# EAGLE design StepDown (EAGLE 6.5.0)
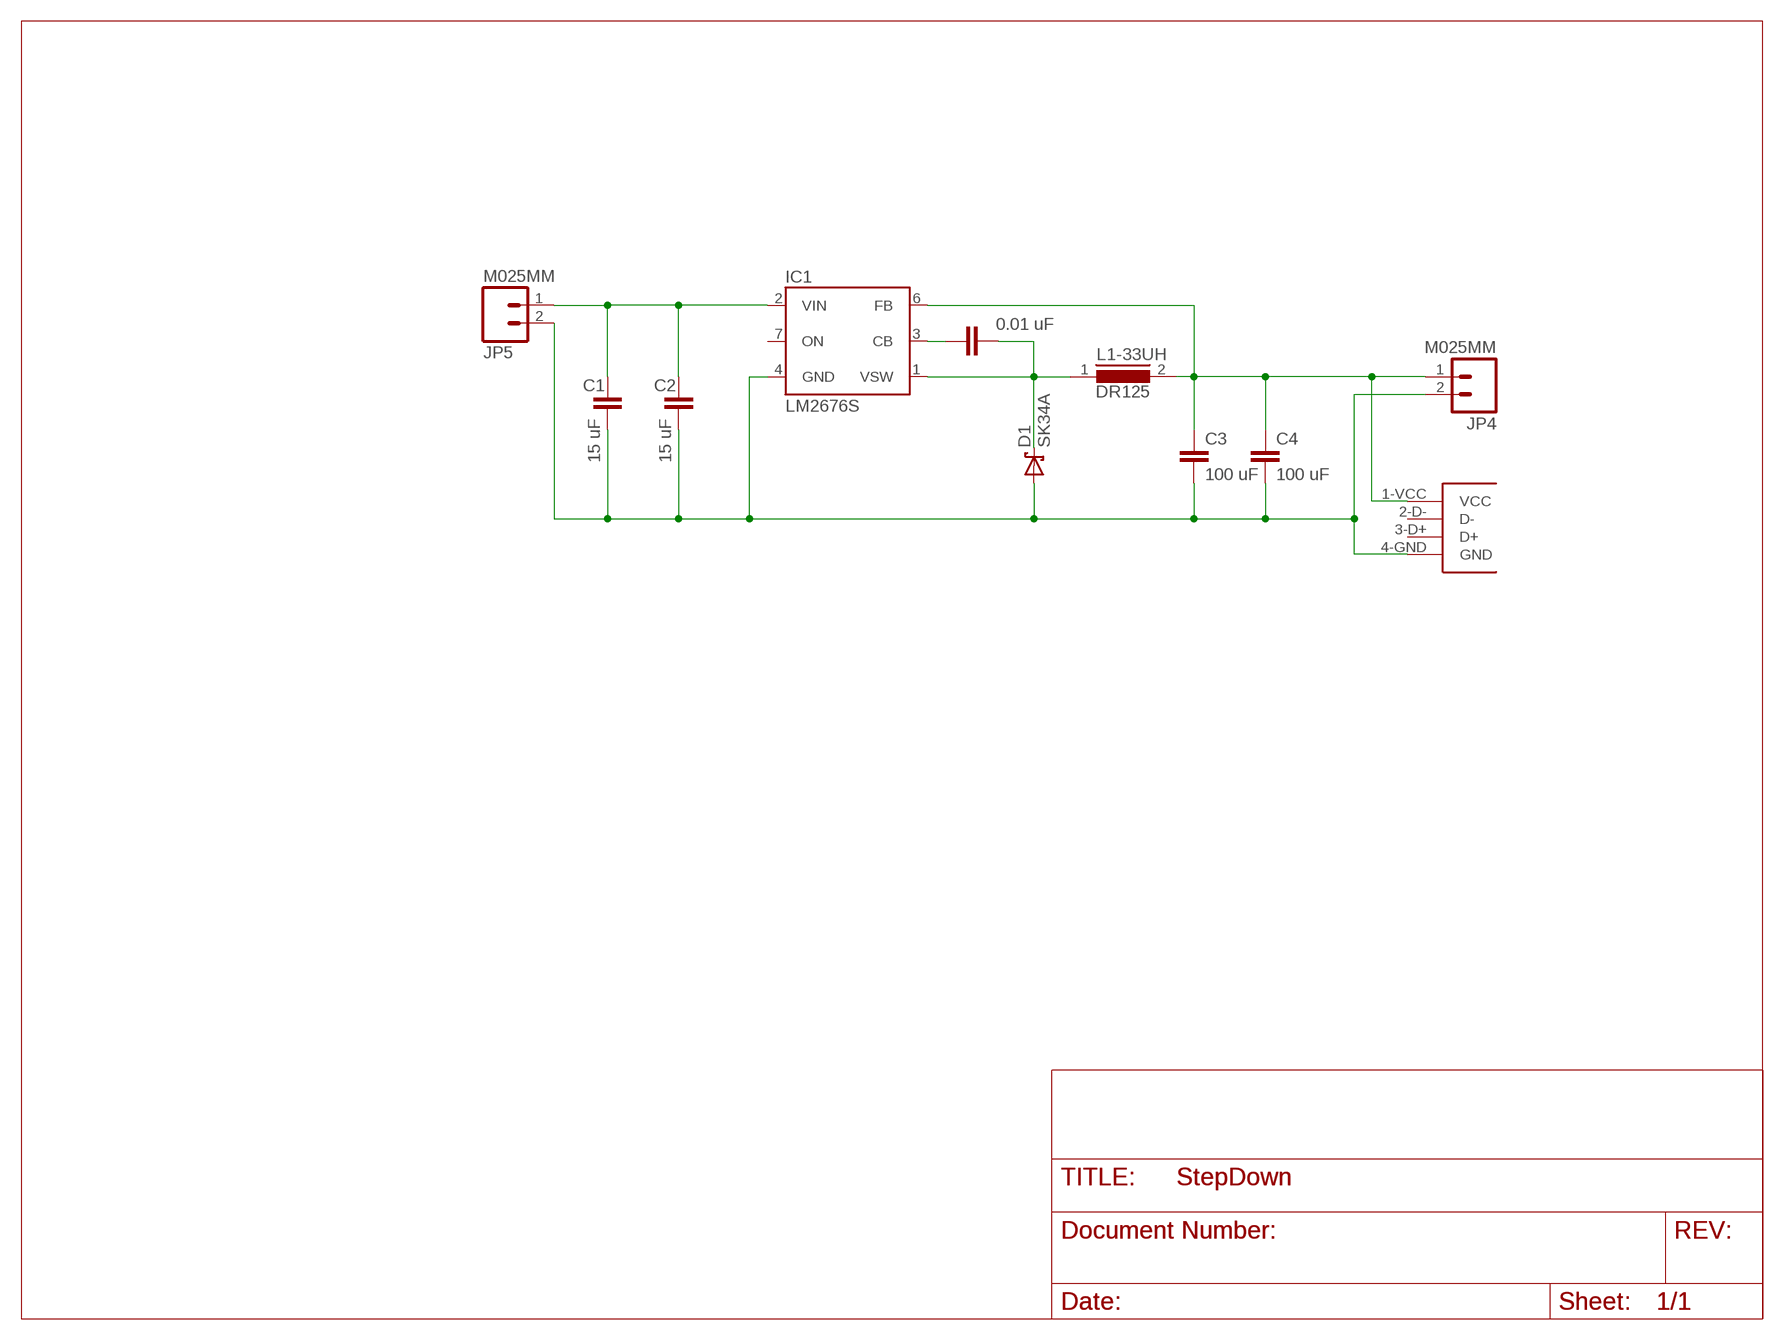
[diagram p0: schematic, sheet 1]

## Parts
C1  15 uF  C-EUC1210  [C1210]
C2  15 uF  C-EUC1210  [C1210]
C3  100 uF  C-EUC1210  [C1210]
C4  100 uF  C-EUC1210  [C1210]
C6  0.01 uF  1.0UF-25V-+80/-20(0805)  [0805]
D1  SK34A  [DO214AA]
IC1  LM2676S  [TO263-7]
JP4  M025MM  [SCREWTERMINAL-5MM-2]
JP5  M025MM  [SCREWTERMINAL-5MM-2]
L1-33UH  DR125  [DR125]
U$1  87520-USB-A-FEMALE  [87520-USB-A-FEMALE]

## Nets
5V [power]: C3.1 C4.1 IC1.6(FB) JP4.1 L1-33UH.2 U$1.1-VCC(VCC)
CB: C6.1 IC1.3(CB)
GND [ground]: C1.2 C2.2 C3.2 C4.2 D1.A IC1.4(GND) JP4.2 JP5.2 U$1.4-GND(GND)
VIN [power]: C1.1 C2.1 IC1.2(VIN) JP5.1
VSW [power]: C6.2 D1.C IC1.1(VSW) L1-33UH.1
Unconnected: IC1.7(ON) U$1.2-D-(D-) U$1.3-D+(D+)

## Library data of the parts
C1-C4 = rcl:C-EU: CAPACITOR, European symbol
C6 = SparkFun-Capacitors:1.0UF-25V-+80/-20(0805): CAP-11625; PROD_ID: CAP-11625; VALUE: 1.0uF
D1 = sk34:SK34A: SK34A DIODE SCHOTTKY 40V 3A DO214AC
IC1 = v-reg-3:LM2676: National Semiconductor <http://www.national.com> 3.0A "Simple Switcher"(c) 260kHz, Vout 1.2-37V, Vin 40V, 150mOhm DMOS switch, 50µA standby current
JP4 JP5 = SparkFun-Connectors:M02: Standard 2-pin 0.1" header. Use with - straight break away headers ( PRT-00116) - right angle break away headers (PRT-00553) - swiss pins (PRT-00743) - machine pins (PRT-00117) - female headers (PRT-00115) Molex polarized connector foot print use with: PRT-08233 with associated crimp pins and housings. 2.54_SCREWTERM for use with PRT-10571. 3.5mm Screw Terminal footprints for PRT-08084 5mm Screw Terminal footprints for use with PRT-08433
L1-33UH = inductors:DR125: High Power Density, High Efficiency, Shielded Inductors Source: coiltronics_dr_series.pdf
U$1 = mech:87520-USB-A-FEMALE

## Net classes
1 ground: width 0.813 mm, drill 0.61 mm, clearance 0.305 mm
2 power: width 0.813 mm, drill 0.61 mm, clearance 0.305 mm

## Board
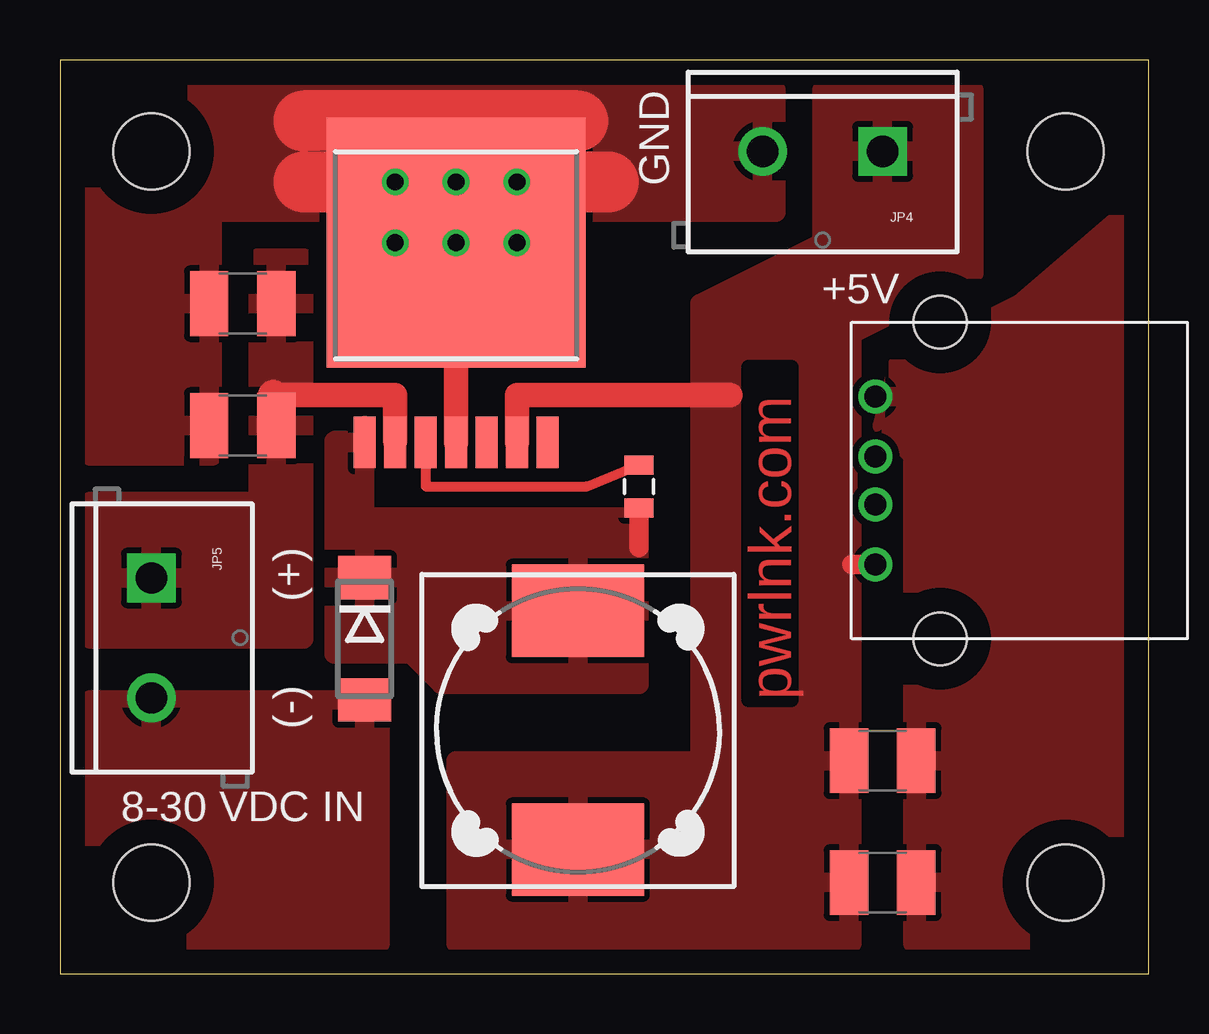
[diagram p1: board, top side]
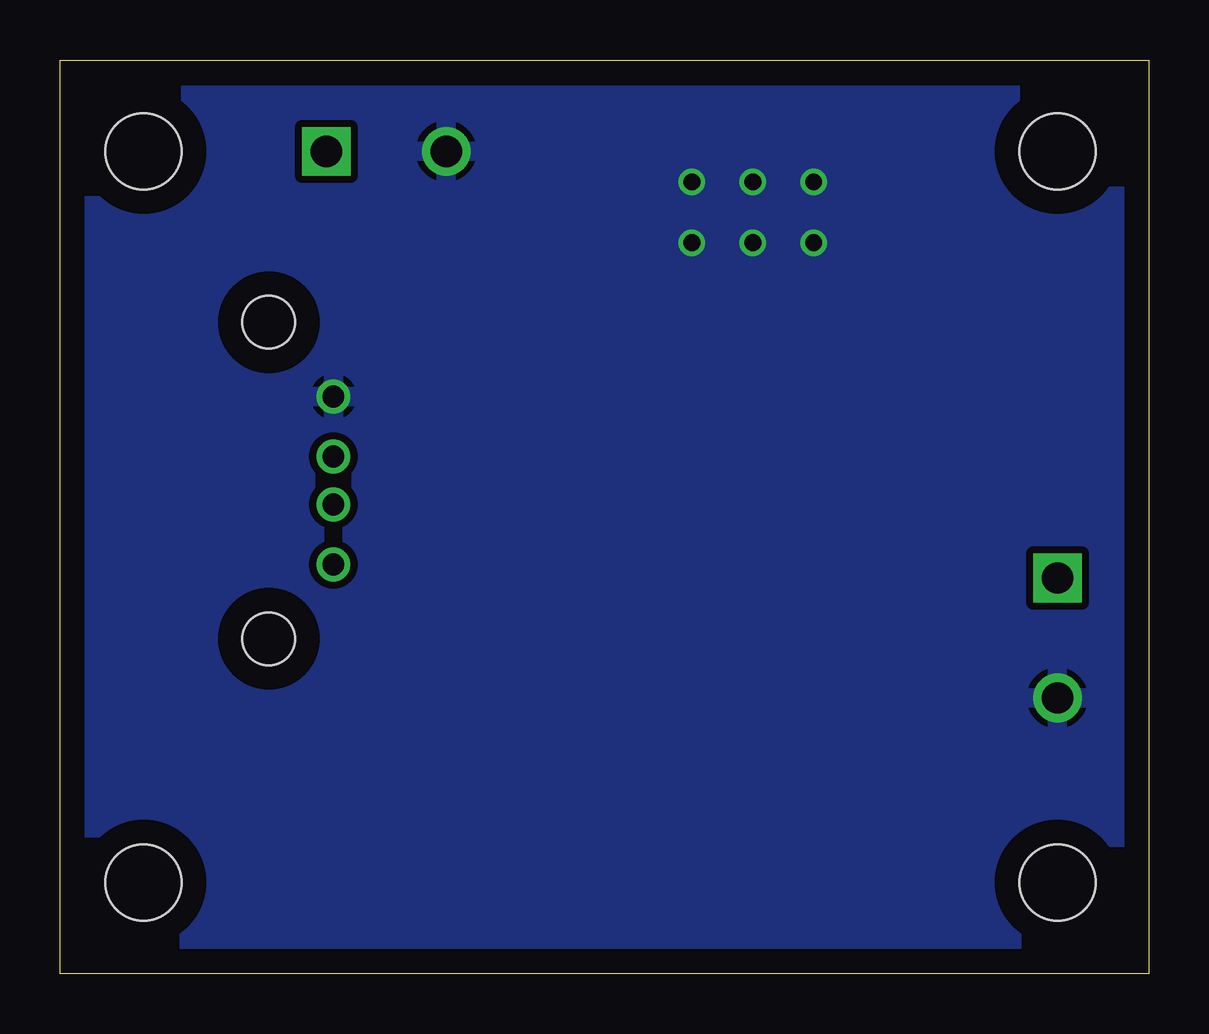
[diagram p2: board, bottom side, seen from below]

Size 45.39 x 38.09 mm. Coordinates in mm from the lower left corner, seen from the top.
Outline: 0,0 45.39,0 45.39,38.09 0,38.09 0,0
Copper layers (1*16): Top 0.035mm / dielectric 1.5mm / Bottom 0.035mm
Design rules "default": minimum track width 10mil, minimum drill 24mil, track to track 8mil, track to pad 8mil, pad to pad 8mil, via to via 8mil, smd to smd 8mil, copper to edge 40mil, drill to drill 8mil, minimum pad ring 10mil, minimum via ring 8mil, stop-mask expansion 4mil, vias tented up to drill 0mil, thermal gap 10mil
Holes 3.17 mm at 3.81,3.81 3.81,34.29 41.91,34.29 41.91,3.81

### Footprints (pad centres in the part's own frame; a part is rotated, then mirrored left to right if it is on the bottom)
C1210 = smd 1.6 x 2.7: 1 -1.4,0; 2 1.4,0
0805 = smd 0.8 x 1.2: 1 -0.9,0; 2 0.9,0
DO214AA = smd 1.8 x 2.2: A 2.55,0; C -2.55,0
TO263-7 = smd 0.91 x 2.16: 1 -3.81,-5.78; 2 -2.54,-5.78; 3 -1.27,-5.78; 4 0,-5.78; 5 1.27,-5.78; 6 2.54,-5.78; 7 3.81,-5.78 | smd 10.8 x 10.41: 8 0,2.54
SCREWTERMINAL-5MM-2 = drill 1.3 pad 2.032 square: 1 0,0 | drill 1.3 pad 2.032: 2 5,0
DR125 = smd 3.85 x 5.5: 1 -4.975,0; 2 4.975,0
87520-USB-A-FEMALE = drill 0.9: 1-VCC 3.1,13; 2-D- 5.6,13; 3-D+ 7.6,13; 4-GND 10.1,13 | hole 2.2: 0,10.3; 13.2,10.3

### Placement (x,y rotation side)
C1  7.62,27.94 180 top
C2  7.62,22.86 180 top
C3  34.29,8.89 0 top
C4  34.29,3.81 0 top
C6  24.13,20.32 270 top
D1  12.7,13.97 270 top
IC1  16.51,27.94 0 top
JP4  34.29,34.29 180 top
JP5  3.81,16.51 270 top
L1-33UH  21.59,10.16 270 top
U$1  46.99,13.97 90 top

### Tracks (layer width: path | path; a pad name or v marks a point on that pad's centre or on a via)
5V
  Top 0.813: U$1.1-VCC 33.02,17.07
  Top 1.016: IC1.6 19.05,24.13 27.94,24.13
  pour Top: 16.51,8.89 16.51,1.27 33.02,1.27 33.02,26.67 38.1,29.21 38.1,36.83 31.75,36.83 31.75,30.48 26.67,27.94 26.67,8.89
CB
  Top 0.406: IC1.3 15.24,20.32 21.96,20.32 C6.1
GND  (via drill 0.7 pad 0.81)
  Top 1.016: IC1.4 v16.51,33.02
  Top 2.54: 10.16,33.02 22.86,33.02 | 21.59,35.56 10.16,35.56
  other vias: 13.97,33.02 19.05,33.02 19.05,30.48 13.97,30.48 16.51,30.48
  pour Top: 29.84,36.83 24.13,36.83 24.13,31.75 29.84,31.75
  pour Bottom: 1.27,36.83 1.27,1.27 44.45,1.27 44.45,36.83
  pour Top: 1.27,36.83 24.13,36.83 24.13,31.75 6.35,31.75 6.35,21.59 1.27,21.59
  pour Top: 40.01,27.94 34.92,25.4 34.29,22.86 35.56,21.59 35.56,1.27 44.45,1.27 44.45,31.75
  pour Top: 1.27,11.43 13.34,11.43 13.34,1.27 3.81,1.27 1.27,3.81
VIN
  Top 0.813: 13.97,22.23 IC1.2
  Top 1.016: 13.97,22.23 13.97,24.13 8.89,24.13
  Top 1.27: 8.89,22.86 8.89,24.13
  pour Top: 8.26,29.84 10.16,29.84 10.16,13.97 1.27,13.97 1.27,19.68 8.26,19.68
VSW
  Top 0.813: C6.2 24.13,17.78
  pour Top: 11.43,13.34 11.43,22.23 12.7,22.86 12.7,19.05 24.13,19.05 24.13,12.06 15.88,12.06 14.61,13.34

### Text on the board
Top: pwrlnk.com
tPlace: GND | +5V | (-) (+)
_tsilk: 8-30 VDC IN